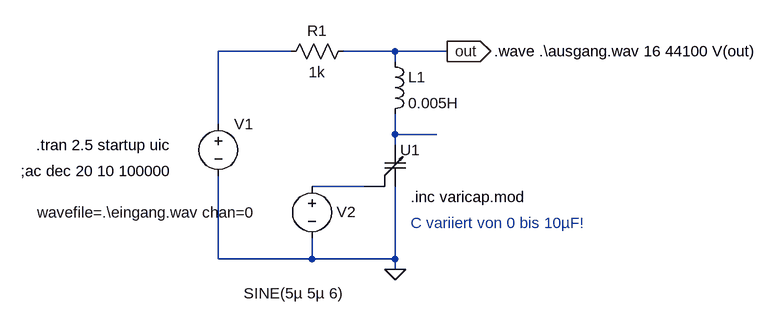
[diagram p0: schematic varicap.asc]
varicap.asc, the LTspice schematic file:
Version 4
SHEET 1 2056 680
WIRE -48 -112 -160 -112
WIRE 112 -112 32 -112
WIRE 192 -112 112 -112
WIRE 112 -96 112 -112
WIRE -160 0 -160 -112
WIRE 112 16 112 -16
WIRE 176 16 112 16
WIRE 112 32 112 16
WIRE 64 96 -16 96
WIRE -160 208 -160 80
WIRE -16 208 -16 176
WIRE -16 208 -160 208
WIRE 112 208 112 96
WIRE 112 208 -16 208
WIRE 112 224 112 208
FLAG 112 224 0
FLAG 192 -112 out
IOPIN 192 -112 Out
SYMBOL voltage -16 80 R0
WINDOW 0 38 55 Left 0
WINDOW 123 0 0 Left 0
WINDOW 39 0 0 Left 0
WINDOW 3 -105 181 Left 0
SYMATTR InstName V2
SYMATTR Value SINE(5µ 5µ 6)
SYMBOL ind 96 -112 R0
SYMATTR InstName L1
SYMATTR Value 0.005H
SYMBOL res 48 -128 R90
WINDOW 0 0 56 VBottom 0
WINDOW 3 32 56 VTop 0
SYMATTR InstName R1
SYMATTR Value 1k
SYMBOL voltage -160 -16 R0
WINDOW 3 -279 152 Left 0
WINDOW 123 0 0 Left 0
WINDOW 39 0 0 Left 0
SYMATTR Value wavefile=.\eingang.wav chan=0
SYMATTR InstName V1
SYMBOL varicap 96 32 R0
SYMATTR InstName U1
SYMATTR SpiceModel varicap
TEXT -440 32 Left 0 !.tran 2.5 startup uic
TEXT 136 112 Left 0 !.inc varicap.mod
TEXT 264 -112 Left 0 !.wave .\\ausgang.wav 16 44100 V(out)
TEXT -464 72 Left 0 !;ac dec 20 10 100000
TEXT 136 152 Left 0 ;C variiert von 0 bis 10µF!

The netlist it stands for:
* varicap.asc
V2 N003 0 SINE(5µ 5µ 6)
L1 out N002 0.005H
R1 out N001 1k
V1 N001 0 wavefile=.\eingang.wav chan=0
XU1 N002 0 N003 varicap  ; pins A B CTRL
.tran 2.5 startup uic
.inc varicap.mod
.wave .\ausgang.wav 16 44100 V(out)
;ac dec 20 10 100000
* C variiert von 0 bis 10µF!
.backanno
.end